# Altium schematic sheet Main_Sch.SchDoc
size A3
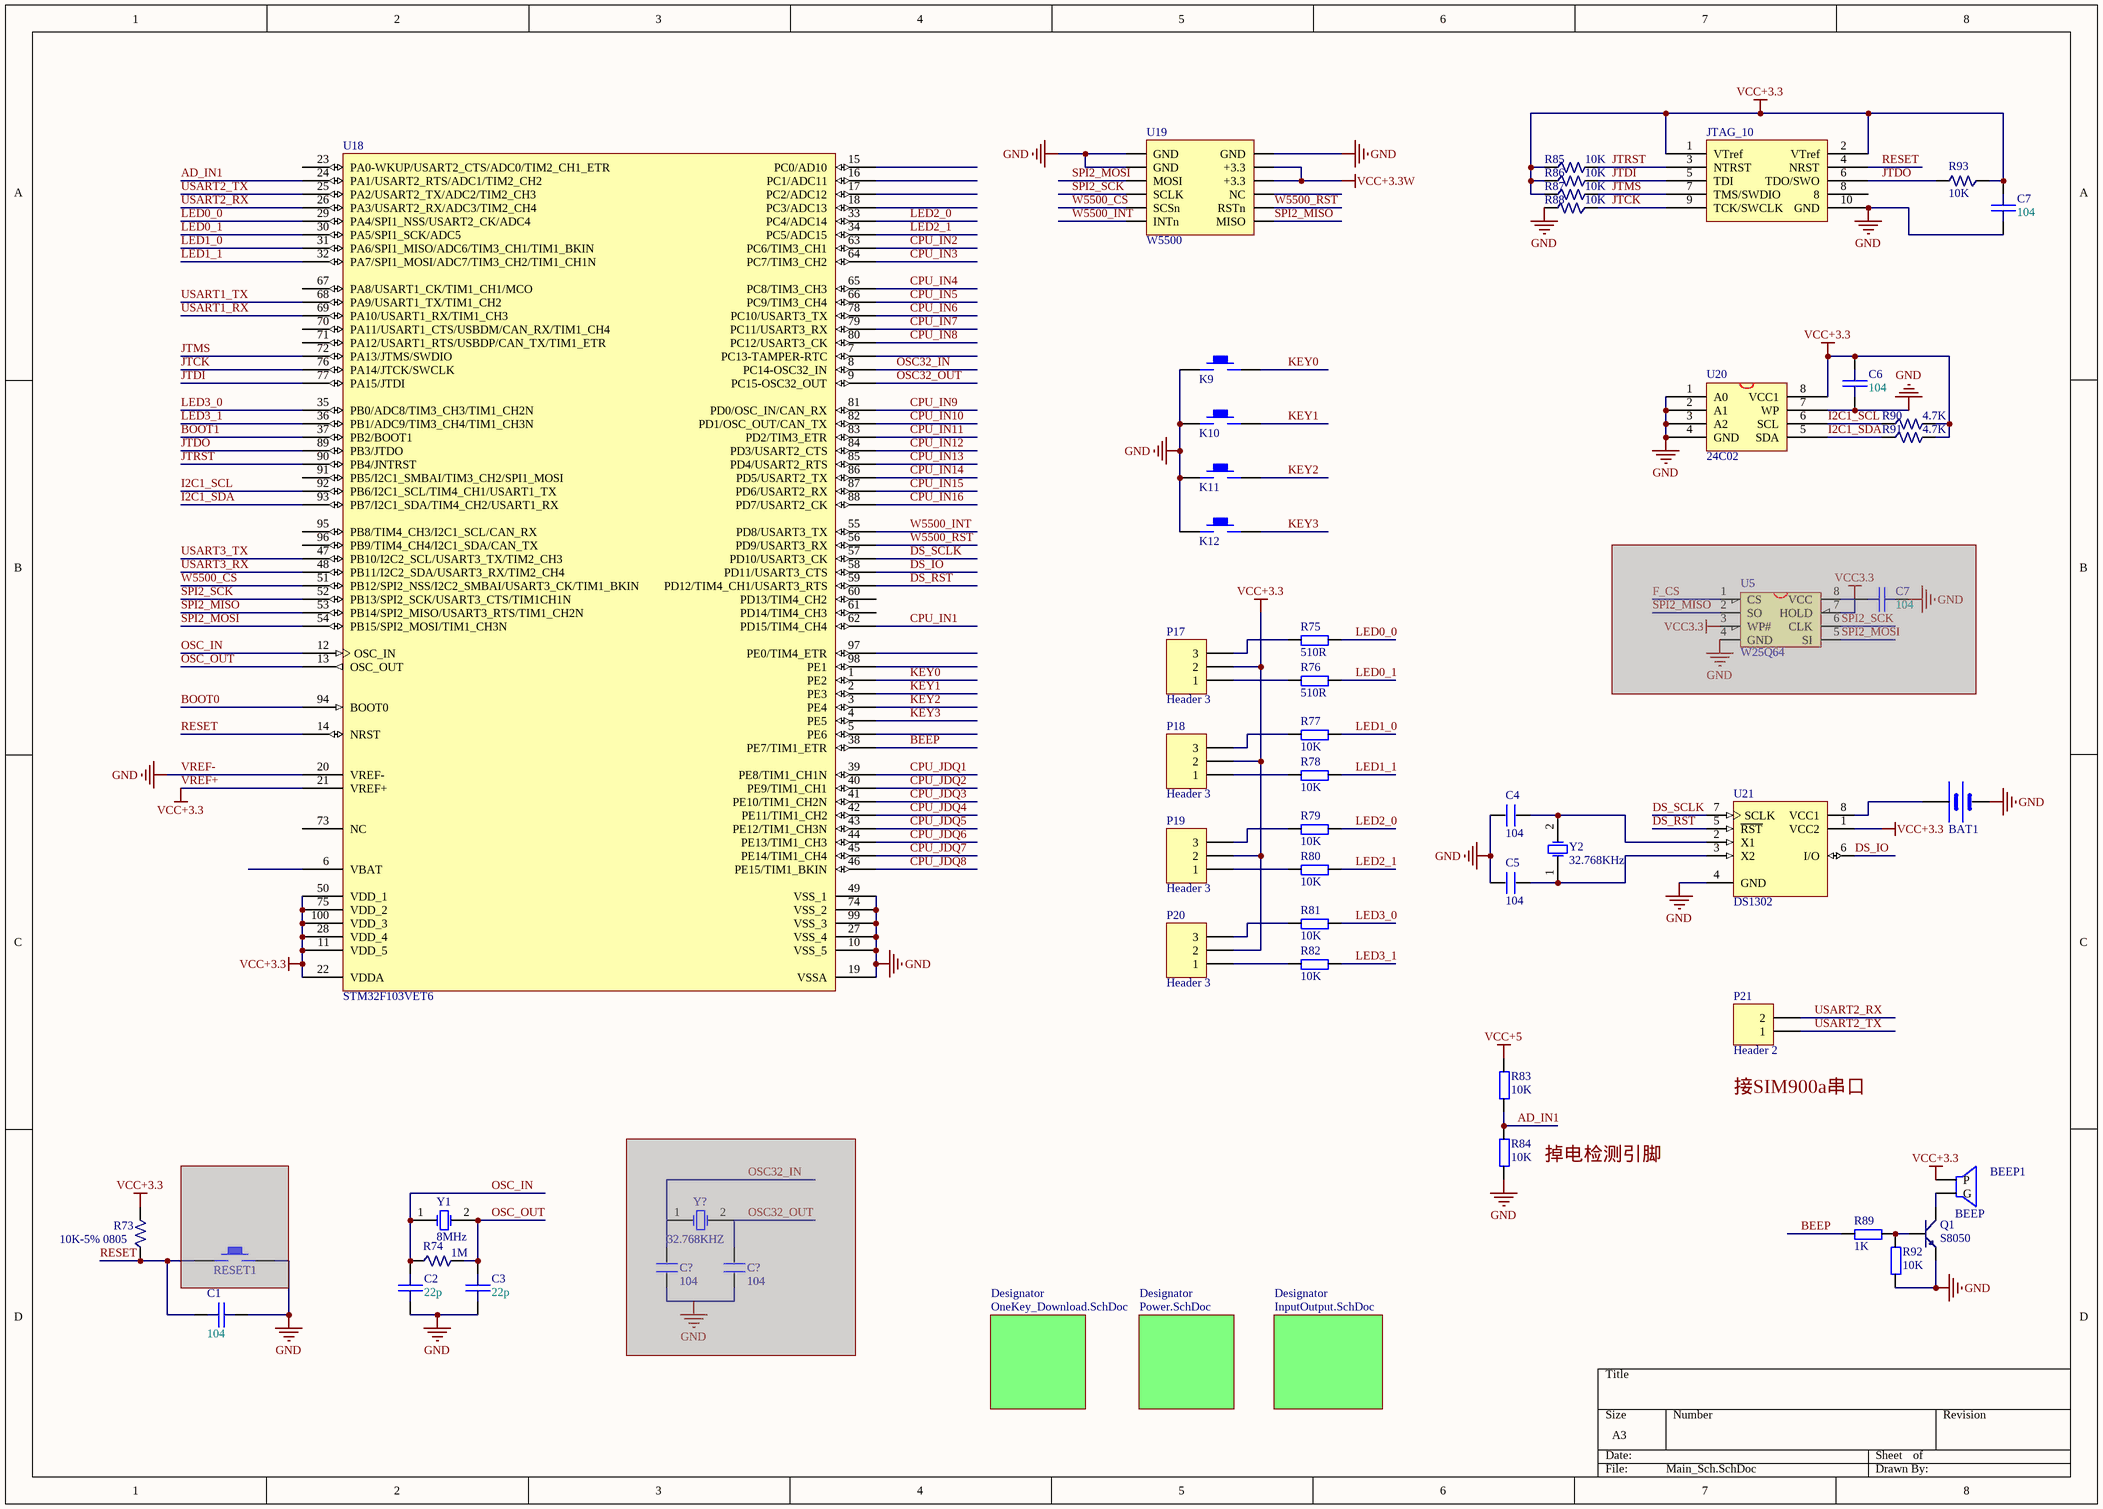
[diagram p0: Main_Sch.SchDoc]

## Parts
(Parts that share a designator on the sheet are numbered #1, #2 ... from top to bottom, then left to right.)
BAT1  BATT  [CR2032]  (value not drawn)
BEEP1  BEEP  [BELL-5]
C1  104  [0805-CAP]
C2  22p  [0805-CAP]
C3  22p  [0805-CAP]
C4  104  [0805-CAP]
C5  104  [0805-CAP]
C6  104  [0805-CAP]
C7#1  104  [0805-CAP]
C7#2  104  [0805-CAP]  (masked out: inside a compile mask, not in the netlist)
C?#1  104  [0805-CAP]  (masked out: inside a compile mask, not in the netlist)
C?#2  104  [0805-CAP]  (masked out: inside a compile mask, not in the netlist)
JTAG_1  JTAG_10  [JTAG_10]
K9  KEY_M  [KEY_M]  (value not drawn)
K10  KEY_M  [KEY_M]  (value not drawn)
K11  KEY_M  [KEY_M]  (value not drawn)
K12  KEY_M  [KEY_M]  (value not drawn)
P17  Header 3  [HDR1X3]
P18  Header 3  [HDR1X3]
P19  Header 3  [HDR1X3]
P20  Header 3  [HDR1X3]
P21  Header 2  [HDR1X2]
Q1  S8050  [SOT-23R]
R73  10K-5% 0805  [0805-RES]
R74  1M  [0805-RES]
R75  510R  [0805-RES]
R76  510R  [0805-RES]
R77  10K  [0805-RES]
R78  10K  [0805-RES]
R79  10K  [0805-RES]
R80  10K  [0805-RES]
R81  10K  [0805-RES]
R82  10K  [0805-RES]
R83  10K  [0805-RES]
R84  10K  [0805-RES]
R85  10K  [0805-RES]
R86  10K  [0805-RES]
R87  10K  [0805-RES]
R88  10K  [0805-RES]
R89  1K  [0805-RES]
R90  4.7K  [0805-RES]
R91  4.7K  [0805-RES]
R92  10K  [0805-RES]
R93  10K  [0805-RES]
RESET1  KEY_M  [KEY_M]  (value not drawn)  (masked out: inside a compile mask, not in the netlist)
U5  W25Q64  [SOIC-8]  (masked out: inside a compile mask, not in the netlist)
U18  STM32F103VET6  [LQFP100_N]
U19  W5500  [W5500-Model]
U20  24C02  [SOP-8]
U21  DS1302  [SOP-8]
Y1  8MHz  [XTAL_US]
Y2  32.768KHz  [XTAL32_1]
Y?  32.768KHZ  [XTAL32_1]  (masked out: inside a compile mask, not in the netlist)

## Sub-sheets
Designator = OneKey_Download.SchDoc: no entries
Designator = Power.SchDoc: no entries
Designator = InputOutput.SchDoc: no entries

## Nets
VCC+3.3W: U19.10(+3.3) U19.11(+3.3)
VCC+5: R83.2
VREF+: BEEP1.1(P) C6.1 C7#1.1 JTAG_1.1(VTref) JTAG_1.2(VTref) P17.2 P18.2 P19.2 P20.2 R73.2 R85.1 R86.1 R87.1 R90.2 R91.2 R93.1 U18.11(VDD_5) U18.21(VREF+) U18.22(VDDA) U18.28(VDD_4) U18.50(VDD_1) U18.75(VDD_2) U18.100(VDD_3) U20.8(VCC1) U21.1(VCC2)  [also labelled VCC+3.3]
VREF-: BAT1.2(GND) C1.2 C2.2 C3.2 C4.1 C5.1 C6.2 C7#1.2 JTAG_1.10(GND) K9.1 K10.1 K11.1 K12.1 Q1.1(E) R84.1 R88.2 R92.1 U18.10(VSS_5) U18.19(VSSA) U18.20(VREF-) U18.27(VSS_4) U18.49(VSS_1) U18.74(VSS_2) U18.99(VSS_3) U19.1(GND) U19.2(GND) U19.12(GND) U20.1(A0) U20.2(A1) U20.3(A2) U20.4(GND) U20.7(WP) U21.4(GND)  [also labelled GND]
AD_IN1: R83.1 R84.2 U18.24(PA1/USART2_RTS/ADC1/TIM2_CH2)
BEEP: R89.1 U18.38(PE7/TIM1_ETR)
BOOT0: U18.94(BOOT0)
BOOT1: U18.37(PB2/BOOT1)
CPU_IN1: U18.62(PD15/TIM4_CH4)
CPU_IN2: U18.63(PC6/TIM3_CH1)
CPU_IN3: U18.64(PC7/TIM3_CH2)
CPU_IN4: U18.65(PC8/TIM3_CH3)
CPU_IN5: U18.66(PC9/TIM3_CH4)
CPU_IN6: U18.78(PC10/USART3_TX)
CPU_IN7: U18.79(PC11/USART3_RX)
CPU_IN8: U18.80(PC12/USART3_CK)
CPU_IN9: U18.81(PD0/OSC_IN/CAN_RX)
CPU_IN10: U18.82(PD1/OSC_OUT/CAN_TX)
CPU_IN11: U18.83(PD2/TIM3_ETR)
CPU_IN12: U18.84(PD3/USART2_CTS)
CPU_IN13: U18.85(PD4/USART2_RTS)
CPU_IN14: U18.86(PD5/USART2_TX)
CPU_IN15: U18.87(PD6/USART2_RX)
CPU_IN16: U18.88(PD7/USART2_CK)
CPU_JDQ1: U18.39(PE8/TIM1_CH1N)
CPU_JDQ2: U18.40(PE9/TIM1_CH1)
CPU_JDQ3: U18.41(PE10/TIM1_CH2N)
CPU_JDQ4: U18.42(PE11/TIM1_CH2)
CPU_JDQ5: U18.43(PE12/TIM1_CH3N)
CPU_JDQ6: U18.44(PE13/TIM1_CH3)
CPU_JDQ7: U18.45(PE14/TIM1_CH4)
CPU_JDQ8: U18.46(PE15/TIM1_BKIN)
DS_IO: U18.58(PD11/USART3_CTS) U21.6(I/O)
DS_RST: U18.59(PD12/TIM4_CH1/USART3_RTS) U21.5(~{RST})
DS_SCLK: U18.57(PD10/USART3_CK) U21.7(SCLK)
I2C1_SCL: R90.1 U18.92(PB6/I2C1_SCL/TIM4_CH1/USART1_TX) U20.6(SCL)
I2C1_SDA: R91.1 U18.93(PB7/I2C1_SDA/TIM4_CH2/USART1_RX) U20.5(SDA)
JTCK: JTAG_1.9(TCK/SWCLK) R88.1 U18.76(PA14/JTCK/SWCLK)
JTDI: JTAG_1.5(TDI) R86.2 U18.77(PA15/JTDI)
JTDO: JTAG_1.6(TDO/SWO) R93.2 U18.89(PB3/JTDO)
JTMS: JTAG_1.7(TMS/SWDIO) R87.2 U18.72(PA13/JTMS/SWDIO)
JTRST: JTAG_1.3(NTRST) R85.2 U18.90(PB4/JNTRST)
KEY0: K9.2 U18.1(PE2)
KEY1: K10.2 U18.2(PE3)
KEY2: K11.2 U18.3(PE4)
KEY3: K12.2 U18.4(PE5)
LED0_0: R75.2 U18.29(PA4/SPI1_NSS/USART2_CK/ADC4)
LED0_1: R76.2 U18.30(PA5/SPI1_SCK/ADC5)
LED1_0: R77.2 U18.31(PA6/SPI1_MISO/ADC6/TIM3_CH1/TIM1_BKIN)
LED1_1: R78.2 U18.32(PA7/SPI1_MOSI/ADC7/TIM3_CH2/TIM1_CH1N)
LED2_0: R79.2 U18.33(PC4/ADC14)
LED2_1: R80.2 U18.34(PC5/ADC15)
LED3_0: R81.2 U18.35(PB0/ADC8/TIM3_CH3/TIM1_CH2N)
LED3_1: R82.2 U18.36(PB1/ADC9/TIM3_CH4/TIM1_CH3N)
OSC32_IN: U18.8(PC14-OSC32_IN)
OSC32_OUT: U18.9(PC15-OSC32_OUT)
OSC_IN: C2.1 R74.1 U18.12(OSC_IN) Y1.1(OSC1)
OSC_OUT: C3.1 R74.2 U18.13(OSC_OUT) Y1.2(OSC2)
RESET: C1.1 JTAG_1.4(NRST) R73.1 U18.14(NRST)
SPI2_MISO: U18.53(PB14/SPI2_MISO/USART3_RTS/TIM1_CH2N) U19.7(MISO)
SPI2_MOSI: U18.54(PB15/SPI2_MOSI/TIM1_CH3N) U19.3(MOSI)
SPI2_SCK: U18.52(PB13/SPI2_SCK/USART3_CTS/TIM1CH1N) U19.4(SCLK)
USART1_RX: U18.69(PA10/USART1_RX/TIM1_CH3)
USART1_TX: U18.68(PA9/USART1_TX/TIM1_CH2)
USART2_RX: P21.2 U18.26(PA3/USART2_RX/ADC3/TIM2_CH4)
USART2_TX: P21.1 U18.25(PA2/USART2_TX/ADC2/TIM2_CH3)
USART3_RX: U18.48(PB11/I2C2_SDA/USART3_RX/TIM2_CH4)
USART3_TX: U18.47(PB10/I2C2_SCL/USART3_TX/TIM2_CH3)
W5500_CS: U18.51(PB12/SPI2_NSS/I2C2_SMBAI/USART3_CK/TIM1_BKIN) U19.5(SCSn)
W5500_INT: U18.55(PD8/USART3_TX) U19.6(INTn)
W5500_RST: U18.56(PD9/USART3_RX) U19.8(RSTn)
NetBAT1_1: BAT1.1(VCC) U21.8(VCC1)
NetBEEP1_2: BEEP1.2(G) Q1.3(C)
NetC4_2: C4.2 U21.2(X1) Y2.2(OSC2)
NetC5_2: C5.2 U21.3(X2) Y2.1(OSC1)
NetP17_1: P17.1 R76.1
NetP17_3: P17.3 R75.1
NetP18_1: P18.1 R78.1
NetP18_3: P18.3 R77.1
NetP19_1: P19.1 R80.1
NetP19_3: P19.3 R79.1
NetP20_1: P20.1 R82.1
NetP20_3: P20.3 R81.1
NetQ1_2: Q1.2(B) R89.2 R92.2

Not connected (* = marked no-connect by the designer): JTAG_1 8; U18 5(PE6) 6(VBAT) 7(PC13-TAMPER-RTC) 15(PC0/AD10) 16(PC1/ADC11) 17(PC2/ADC12) 18(PC3/ADC13) 23(PA0-WKUP/USART2_CTS/ADC0/TIM2_CH1_ETR) 60(PD13/TIM4_CH2) 61(PD14/TIM4_CH3) 67(PA8/USART1_CK/TIM1_CH1/MCO) 70(PA11/USART1_CTS/USBDM/CAN_RX/TIM1_CH4) 71(PA12/USART1_RTS/USBDP/CAN_TX/TIM1_ETR) 73(NC) 91(PB5/I2C1_SMBAI/TIM3_CH2/SPI1_MOSI) 95(PB8/TIM4_CH3/I2C1_SCL/CAN_RX) 96(PB9/TIM4_CH4/I2C1_SDA/CAN_TX) 97(PE0/TIM4_ETR) 98(PE1); U19 9(NC)

## Notes on the sheet
- (near P21) 接SIM900a串口
- 掉电检测引脚

## Library data of the parts
BAT1 = BAT
C1-C3 C6 C7#1 C7#2 = CAP: 陶瓷电容
C4 C5 C?#1 C?#2 = C
P17-P20 = Header 3: Header, 3-Pin; LatestRevisionDate: 17-Jul-2002; LatestRevisionNote: Re-released for DXP Platform.; Publisher: Altium Limited
P21 = Header 2: Header, 2-Pin; LatestRevisionDate: 17-Jul-2002; LatestRevisionNote: Re-released for DXP Platform.; Publisher: Altium Limited
Q1 = NPN: 8050/BCW846/BCW847
R73 R74 R85-R88 R90 R91 R93 = RES-1%: 高精度电阻
R75-R84 = Res
R89 R92 = R
U5 = W25X16: W25X16;SST25VF016;MX25L1605
U18 = STM32F103VET6: STM32 ARM-based 32-bit MCU with 64 Kbytes Flash, 100-pin LQFP, Industrial Temperature; Published: 30-May-2008; DatasheetVersion: rev6, Mar-2008; PackageVersion: Mar-2008; PackageReference: LQFP100; Publisher: Altium Limited; PackageDescription: 100-Pin Low-Profile Quad Flat Pack, 14 x 14 mm Body, 0.5 mm Pitch (LQFP100); ComponentLink1Description: Manufacturer Link; ComponentLink1URL: www.st.com/stm32; ComponentLink2Description: Datasheet; ComponentLink2URL: http://www.st.com/stonline/products/literature/ds/13587.pdf
U20 = 24C256
U21 = DS1302: 实时时钟
Y1 Y2 Y? = XTAL: Crystal Oscillator; Published: 8-Jun-2000; LatestRevisionDate: 17-Jul-2002; LatestRevisionNote: Re-released for DXP Platform.; Publisher: Altium Limited